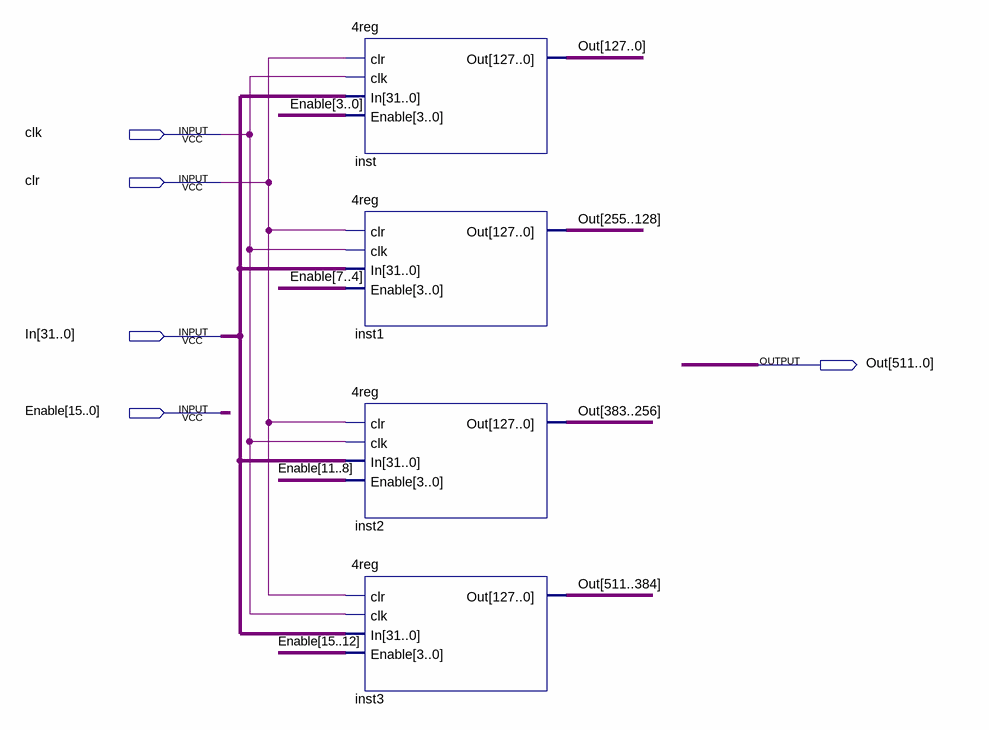
[diagram p0: schematic sheet]
// Quartus schematic 16reg.bdf as structural Verilog: 4 symbols, 5 pins
module \16reg  (
  input  clk,
  input  clr,
  input  [31:0] In,
  input  [15:0] Enable,
  output [511:0] Out
);

  \4reg  inst (.clr(clr), .clk(clk), .In(In), .Enable(Enable[3:0]), .Out(Out[127:0]));
  \4reg  inst1 (.clr(clr), .clk(clk), .In(In), .Enable(Enable[7:4]), .Out(Out[255:128]));
  \4reg  inst2 (.clr(clr), .clk(clk), .In(In), .Enable(Enable[11:8]), .Out(Out[383:256]));
  \4reg  inst3 (.clr(clr), .clk(clk), .In(In), .Enable(Enable[15:12]), .Out(Out[511:384]));
endmodule
